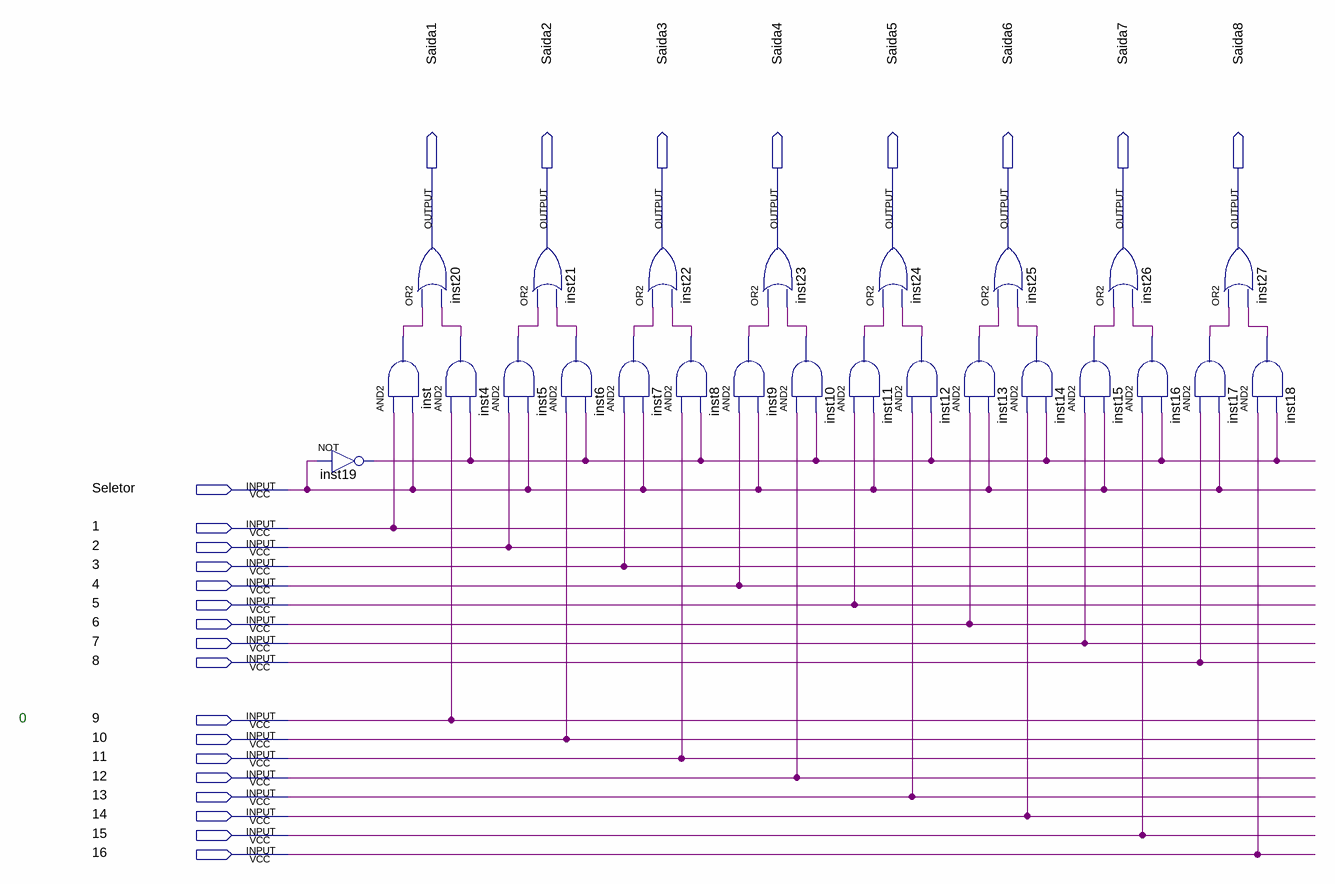
[diagram p0: schematic sheet]
// Quartus schematic Mux2x1.bdf as structural Verilog: 25 symbols, 25 pins
module Mux2x1 (
  input  Seletor,
  input  \1 ,
  input  \2 ,
  input  \3 ,
  input  \4 ,
  input  \5 ,
  input  \6 ,
  input  \7 ,
  input  \8 ,
  input  \9 ,
  input  \10 ,
  input  \11 ,
  input  \12 ,
  input  \13 ,
  input  \14 ,
  input  \15 ,
  input  \16 ,
  output Saida1,
  output Saida2,
  output Saida3,
  output Saida4,
  output Saida5,
  output Saida6,
  output Saida7,
  output Saida8
);

  wire inst4_out, inst5_out, inst6_out, inst7_out, inst8_out, inst9_out, inst10_out, inst11_out, inst12_out,
       inst13_out, inst14_out, inst15_out, inst16_out, inst17_out, inst18_out, inst19_out, inst_out;

  not inst19 (inst19_out, Seletor);
  or inst20 (Saida1, inst_out, inst4_out);
  and inst (inst_out, \1 , Seletor);
  and inst4 (inst4_out, \9 , inst19_out);
  or inst21 (Saida2, inst5_out, inst6_out);
  and inst5 (inst5_out, \2 , Seletor);
  and inst6 (inst6_out, \10 , inst19_out);
  or inst22 (Saida3, inst7_out, inst8_out);
  and inst7 (inst7_out, \3 , Seletor);
  and inst8 (inst8_out, \11 , inst19_out);
  or inst23 (Saida4, inst9_out, inst10_out);
  and inst9 (inst9_out, \4 , Seletor);
  and inst10 (inst10_out, \12 , inst19_out);
  or inst24 (Saida5, inst11_out, inst12_out);
  and inst11 (inst11_out, \5 , Seletor);
  and inst12 (inst12_out, \13 , inst19_out);
  or inst25 (Saida6, inst13_out, inst14_out);
  and inst13 (inst13_out, \6 , Seletor);
  and inst14 (inst14_out, \14 , inst19_out);
  or inst26 (Saida7, inst15_out, inst16_out);
  and inst15 (inst15_out, \7 , Seletor);
  and inst16 (inst16_out, \15 , inst19_out);
  or inst27 (Saida8, inst17_out, inst18_out);
  and inst17 (inst17_out, \8 , Seletor);
  and inst18 (inst18_out, \16 , inst19_out);

  // Notes on the sheet:
  //   0
endmodule
